# Altium schematic sheet key_matrix.SchDoc
size A4
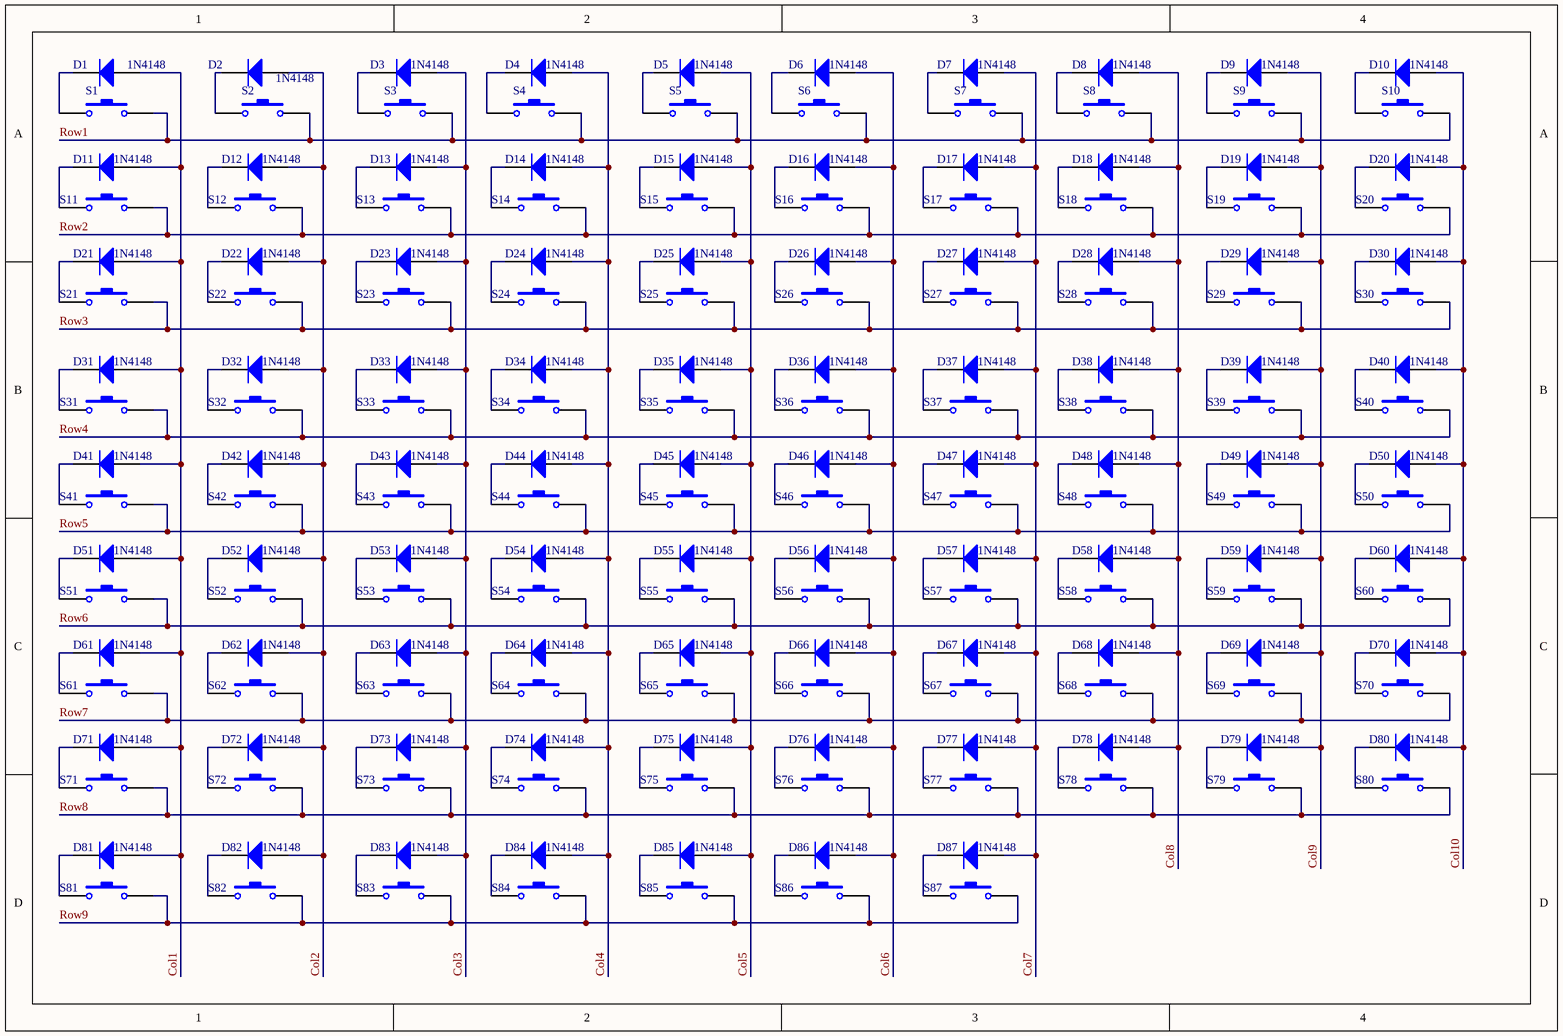
[diagram p0: key_matrix.SchDoc]

## Parts
D1  1N4148  [SOD-80]
D2  1N4148  [SOD-80]
D3  1N4148  [SOD-80]
D4  1N4148  [SOD-80]
D5  1N4148  [SOD-80]
D6  1N4148  [SOD-80]
D7  1N4148  [SOD-80]
D8  1N4148  [SOD-80]
D9  1N4148  [SOD-80]
D10  1N4148  [SOD-80]
D11  1N4148  [SOD-80]
D12  1N4148  [SOD-80]
D13  1N4148  [SOD-80]
D14  1N4148  [SOD-80]
D15  1N4148  [SOD-80]
D16  1N4148  [SOD-80]
D17  1N4148  [SOD-80]
D18  1N4148  [SOD-80]
D19  1N4148  [SOD-80]
D20  1N4148  [SOD-80]
D21  1N4148  [SOD-80]
D22  1N4148  [SOD-80]
D23  1N4148  [SOD-80]
D24  1N4148  [SOD-80]
D25  1N4148  [SOD-80]
D26  1N4148  [SOD-80]
D27  1N4148  [SOD-80]
D28  1N4148  [SOD-80]
D29  1N4148  [SOD-80]
D30  1N4148  [SOD-80]
D31  1N4148  [SOD-80]
D32  1N4148  [SOD-80]
D33  1N4148  [SOD-80]
D34  1N4148  [SOD-80]
D35  1N4148  [SOD-80]
D36  1N4148  [SOD-80]
D37  1N4148  [SOD-80]
D38  1N4148  [SOD-80]
D39  1N4148  [SOD-80]
D40  1N4148  [SOD-80]
D41  1N4148  [SOD-80]
D42  1N4148  [SOD-80]
D43  1N4148  [SOD-80]
D44  1N4148  [SOD-80]
D45  1N4148  [SOD-80]
D46  1N4148  [SOD-80]
D47  1N4148  [SOD-80]
D48  1N4148  [SOD-80]
D49  1N4148  [SOD-80]
D50  1N4148  [SOD-80]
D51  1N4148  [SOD-80]
D52  1N4148  [SOD-80]
D53  1N4148  [SOD-80]
D54  1N4148  [SOD-80]
D55  1N4148  [SOD-80]
D56  1N4148  [SOD-80]
D57  1N4148  [SOD-80]
D58  1N4148  [SOD-80]
D59  1N4148  [SOD-80]
D60  1N4148  [SOD-80]
D61  1N4148  [SOD-80]
D62  1N4148  [SOD-80]
D63  1N4148  [SOD-80]
D64  1N4148  [SOD-80]
D65  1N4148  [SOD-80]
D66  1N4148  [SOD-80]
D67  1N4148  [SOD-80]
D68  1N4148  [SOD-80]
D69  1N4148  [SOD-80]
D70  1N4148  [SOD-80]
D71  1N4148  [SOD-80]
D72  1N4148  [SOD-80]
D73  1N4148  [SOD-80]
D74  1N4148  [SOD-80]
D75  1N4148  [SOD-80]
D76  1N4148  [SOD-80]
D77  1N4148  [SOD-80]
D78  1N4148  [SOD-80]
D79  1N4148  [SOD-80]
D80  1N4148  [SOD-80]
D81  1N4148  [SOD-80]
D82  1N4148  [SOD-80]
D83  1N4148  [SOD-80]
D84  1N4148  [SOD-80]
D85  1N4148  [SOD-80]
D86  1N4148  [SOD-80]
D87  1N4148  [SOD-80]
S1  SW-PB  [MX_SW-1]  (value not drawn)
S2  SW-PB  [MX_SW-1]  (value not drawn)
S3  SW-PB  [MX_SW-1]  (value not drawn)
S4  SW-PB  [MX_SW-1]  (value not drawn)
S5  SW-PB  [MX_SW-1]  (value not drawn)
S6  SW-PB  [MX_SW-1]  (value not drawn)
S7  SW-PB  [MX_SW-1]  (value not drawn)
S8  SW-PB  [MX_SW-1]  (value not drawn)
S9  SW-PB  [MX_SW-1]  (value not drawn)
S10  SW-PB  [MX_SW-1]  (value not drawn)
S11  SW-PB  [MX_SW-1]  (value not drawn)
S12  SW-PB  [MX_SW-1]  (value not drawn)
S13  SW-PB  [MX_SW-1]  (value not drawn)
S14  SW-PB  [MX_SW-1]  (value not drawn)
S15  SW-PB  [MX_SW-1]  (value not drawn)
S16  SW-PB  [MX_SW-1]  (value not drawn)
S17  SW-PB  [MX_SW-1]  (value not drawn)
S18  SW-PB  [MX_SW-1]  (value not drawn)
S19  SW-PB  [MX_SW-1]  (value not drawn)
S20  SW-PB  [MX_SW-1]  (value not drawn)
S21  SW-PB  [MX_SW-1]  (value not drawn)
S22  SW-PB  [MX_SW-1]  (value not drawn)
S23  SW-PB  [MX_SW-1]  (value not drawn)
S24  SW-PB  [MX_SW-1]  (value not drawn)
S25  SW-PB  [MX_SW-1]  (value not drawn)
S26  SW-PB  [MX_SW-1]  (value not drawn)
S27  SW-PB  [MX_SW-1]  (value not drawn)
S28  SW-PB  [MX_SW-1]  (value not drawn)
S29  SW-PB  [MX_SW-1]  (value not drawn)
S30  SW-PB  [MX_SW-1]  (value not drawn)
S31  SW-PB  [MX_SW-1]  (value not drawn)
S32  SW-PB  [MX_SW-1]  (value not drawn)
S33  SW-PB  [MX_SW-1]  (value not drawn)
S34  SW-PB  [MX_SW-1]  (value not drawn)
S35  SW-PB  [MX_SW-1]  (value not drawn)
S36  SW-PB  [MX_SW-1]  (value not drawn)
S37  SW-PB  [MX_SW-1]  (value not drawn)
S38  SW-PB  [MX_SW-1]  (value not drawn)
S39  SW-PB  [MX_SW-1]  (value not drawn)
S40  SW-PB  [MX_SW-1]  (value not drawn)
S41  SW-PB  [MX_SW-1]  (value not drawn)
S42  SW-PB  [MX_SW-1]  (value not drawn)
S43  SW-PB  [MX_SW-1]  (value not drawn)
S44  SW-PB  [MX_SW-1]  (value not drawn)
S45  SW-PB  [MX_SW-1]  (value not drawn)
S46  SW-PB  [MX_SW-1]  (value not drawn)
S47  SW-PB  [MX_SW-1]  (value not drawn)
S48  SW-PB  [MX_SW-1]  (value not drawn)
S49  SW-PB  [MX_SW-1]  (value not drawn)
S50  SW-PB  [MX_SW-1]  (value not drawn)
S51  SW-PB  [MX_SW-1]  (value not drawn)
S52  SW-PB  [MX_SW-1]  (value not drawn)
S53  SW-PB  [MX_SW-1]  (value not drawn)
S54  SW-PB  [MX_SW-1]  (value not drawn)
S55  SW-PB  [MX_SW-1]  (value not drawn)
S56  SW-PB  [MX_SW-1]  (value not drawn)
S57  SW-PB  [MX_SW-1]  (value not drawn)
S58  SW-PB  [MX_SW-1]  (value not drawn)
S59  SW-PB  [MX_SW-1]  (value not drawn)
S60  SW-PB  [MX_SW-1]  (value not drawn)
S61  SW-PB  [MX_SW-1]  (value not drawn)
S62  SW-PB  [MX_SW-1]  (value not drawn)
S63  SW-PB  [MX_SW-1]  (value not drawn)
S64  SW-PB  [MX_SW-1]  (value not drawn)
S65  SW-PB  [MX_SW-1]  (value not drawn)
S66  SW-PB  [MX_SW-1]  (value not drawn)
S67  SW-PB  [MX_SW-1]  (value not drawn)
S68  SW-PB  [MX_SW-1]  (value not drawn)
S69  SW-PB  [MX_SW-1]  (value not drawn)
S70  SW-PB  [MX_SW-1]  (value not drawn)
S71  SW-PB  [MX_SW-1]  (value not drawn)
S72  SW-PB  [MX_SW-1]  (value not drawn)
S73  SW-PB  [MX_SW-1]  (value not drawn)
S74  SW-PB  [MX_SW-1]  (value not drawn)
S75  SW-PB  [MX_SW-1]  (value not drawn)
S76  SW-PB  [MX_SW-1]  (value not drawn)
S77  SW-PB  [MX_SW-1]  (value not drawn)
S78  SW-PB  [MX_SW-1]  (value not drawn)
S79  SW-PB  [MX_SW-1]  (value not drawn)
S80  SW-PB  [MX_SW-1]  (value not drawn)
S81  SW-PB  [MX_SW-1]  (value not drawn)
S82  SW-PB  [MX_SW-1]  (value not drawn)
S83  SW-PB  [MX_SW-1]  (value not drawn)
S84  SW-PB  [MX_SW-1]  (value not drawn)
S85  SW-PB  [MX_SW-1]  (value not drawn)
S86  SW-PB  [MX_SW-1]  (value not drawn)
S87  SW-PB  [MX_SW-1]  (value not drawn)

## Nets
Col1: D1.1(A) D11.1(A) D21.1(A) D31.1(A) D41.1(A) D51.1(A) D61.1(A) D71.1(A) D81.1(A)
Col2: D2.1(A) D12.1(A) D22.1(A) D32.1(A) D42.1(A) D52.1(A) D62.1(A) D72.1(A) D82.1(A)
Col3: D3.1(A) D13.1(A) D23.1(A) D33.1(A) D43.1(A) D53.1(A) D63.1(A) D73.1(A) D83.1(A)
Col4: D4.1(A) D14.1(A) D24.1(A) D34.1(A) D44.1(A) D54.1(A) D64.1(A) D74.1(A) D84.1(A)
Col5: D5.1(A) D15.1(A) D25.1(A) D35.1(A) D45.1(A) D55.1(A) D65.1(A) D75.1(A) D85.1(A)
Col6: D6.1(A) D16.1(A) D26.1(A) D36.1(A) D46.1(A) D56.1(A) D66.1(A) D76.1(A) D86.1(A)
Col7: D7.1(A) D17.1(A) D27.1(A) D37.1(A) D47.1(A) D57.1(A) D67.1(A) D77.1(A) D87.1(A)
Col8: D8.1(A) D18.1(A) D28.1(A) D38.1(A) D48.1(A) D58.1(A) D68.1(A) D78.1(A)
Col9: D9.1(A) D19.1(A) D29.1(A) D39.1(A) D49.1(A) D59.1(A) D69.1(A) D79.1(A)
Col10: D10.1(A) D20.1(A) D30.1(A) D40.1(A) D50.1(A) D60.1(A) D70.1(A) D80.1(A)
Row1: S1.2 S2.2 S3.2 S4.2 S5.2 S6.2 S7.2 S8.2 S9.2 S10.2
Row2: S11.2 S12.2 S13.2 S14.2 S15.2 S16.2 S17.2 S18.2 S19.2 S20.2
Row3: S21.2 S22.2 S23.2 S24.2 S25.2 S26.2 S27.2 S28.2 S29.2 S30.2
Row4: S31.2 S32.2 S33.2 S34.2 S35.2 S36.2 S37.2 S38.2 S39.2 S40.2
Row5: S41.2 S42.2 S43.2 S44.2 S45.2 S46.2 S47.2 S48.2 S49.2 S50.2
Row6: S51.2 S52.2 S53.2 S54.2 S55.2 S56.2 S57.2 S58.2 S59.2 S60.2
Row7: S61.2 S62.2 S63.2 S64.2 S65.2 S66.2 S67.2 S68.2 S69.2 S70.2
Row8: S71.2 S72.2 S73.2 S74.2 S75.2 S76.2 S77.2 S78.2 S79.2 S80.2
Row9: S81.2 S82.2 S83.2 S84.2 S85.2 S86.2 S87.2
NetD1_2: D1.2(K) S1.1
NetD2_2: D2.2(K) S2.1
NetD3_2: D3.2(K) S3.1
NetD4_2: D4.2(K) S4.1
NetD5_2: D5.2(K) S5.1
NetD6_2: D6.2(K) S6.1
NetD7_2: D7.2(K) S7.1
NetD8_2: D8.2(K) S8.1
NetD9_2: D9.2(K) S9.1
NetD10_2: D10.2(K) S10.1
NetD11_2: D11.2(K) S11.1
NetD12_2: D12.2(K) S12.1
NetD13_2: D13.2(K) S13.1
NetD14_2: D14.2(K) S14.1
NetD15_2: D15.2(K) S15.1
NetD16_2: D16.2(K) S16.1
NetD17_2: D17.2(K) S17.1
NetD18_2: D18.2(K) S18.1
NetD19_2: D19.2(K) S19.1
NetD20_2: D20.2(K) S20.1
NetD21_2: D21.2(K) S21.1
NetD22_2: D22.2(K) S22.1
NetD23_2: D23.2(K) S23.1
NetD24_2: D24.2(K) S24.1
NetD25_2: D25.2(K) S25.1
NetD26_2: D26.2(K) S26.1
NetD27_2: D27.2(K) S27.1
NetD28_2: D28.2(K) S28.1
NetD29_2: D29.2(K) S29.1
NetD30_2: D30.2(K) S30.1
NetD31_2: D31.2(K) S31.1
NetD32_2: D32.2(K) S32.1
NetD33_2: D33.2(K) S33.1
NetD34_2: D34.2(K) S34.1
NetD35_2: D35.2(K) S35.1
NetD36_2: D36.2(K) S36.1
NetD37_2: D37.2(K) S37.1
NetD38_2: D38.2(K) S38.1
NetD39_2: D39.2(K) S39.1
NetD40_2: D40.2(K) S40.1
NetD41_2: D41.2(K) S41.1
NetD42_2: D42.2(K) S42.1
NetD43_2: D43.2(K) S43.1
NetD44_2: D44.2(K) S44.1
NetD45_2: D45.2(K) S45.1
NetD46_2: D46.2(K) S46.1
NetD47_2: D47.2(K) S47.1
NetD48_2: D48.2(K) S48.1
NetD49_2: D49.2(K) S49.1
NetD50_2: D50.2(K) S50.1
NetD51_2: D51.2(K) S51.1
NetD52_2: D52.2(K) S52.1
NetD53_2: D53.2(K) S53.1
NetD54_2: D54.2(K) S54.1
NetD55_2: D55.2(K) S55.1
NetD56_2: D56.2(K) S56.1
NetD57_2: D57.2(K) S57.1
NetD58_2: D58.2(K) S58.1
NetD59_2: D59.2(K) S59.1
NetD60_2: D60.2(K) S60.1
NetD61_2: D61.2(K) S61.1
NetD62_2: D62.2(K) S62.1
NetD63_2: D63.2(K) S63.1
NetD64_2: D64.2(K) S64.1
NetD65_2: D65.2(K) S65.1
NetD66_2: D66.2(K) S66.1
NetD67_2: D67.2(K) S67.1
NetD68_2: D68.2(K) S68.1
NetD69_2: D69.2(K) S69.1
NetD70_2: D70.2(K) S70.1
NetD71_2: D71.2(K) S71.1
NetD72_2: D72.2(K) S72.1
NetD73_2: D73.2(K) S73.1
NetD74_2: D74.2(K) S74.1
NetD75_2: D75.2(K) S75.1
NetD76_2: D76.2(K) S76.1
NetD77_2: D77.2(K) S77.1
NetD78_2: D78.2(K) S78.1
NetD79_2: D79.2(K) S79.1
NetD80_2: D80.2(K) S80.1
NetD81_2: D81.2(K) S81.1
NetD82_2: D82.2(K) S82.1
NetD83_2: D83.2(K) S83.1
NetD84_2: D84.2(K) S84.1
NetD85_2: D85.2(K) S85.1
NetD86_2: D86.2(K) S86.1
NetD87_2: D87.2(K) S87.1

## Library data of the parts
D1-D87 = Diode 1N4148: High Conductance Fast Diode; Published: 8-Jun-2000; LatestRevisionDate: 17-Jul-2002; LatestRevisionNote: Re-released for DXP Platform.; DatasheetVersion: 1997; PackageReference: DO-35; Publisher: Altium Limited; PackageDescription: Diode, Axial; Body 3.8 x 1.9 mm (LxDia. max), Lead Dia. 0.53 mm (max); Code_JEDEC: DO-204-AH; ComponentLink1Description: Manufacturer Link; ComponentLink1URL: http://www.fairchildsemi.com/; ComponentLink2Description: Datasheet; ComponentLink2URL: http://www.fairchildsemi.com/ds/1N%2F1N4148.pdf
S1-S87 = SW-PB: Switch; Published: 24-Mar-1999; LatestRevisionDate: 17-Jul-2002; LatestRevisionNote: Re-released for DXP Platform.; PackageReference: SPST-2; Publisher: Altium Limited; PackageDescription: Switch; 2 Leads